# EAGLE design ttl (EAGLE 9.3.1)
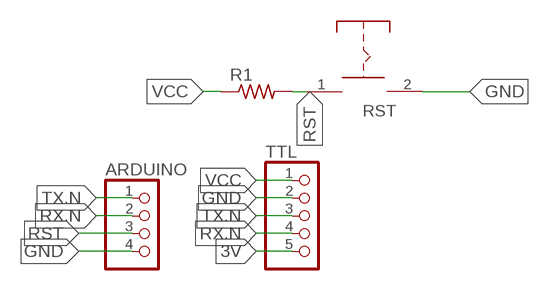
[diagram p0: schematic, sheet 1]

## Parts
ARDUINO  PINHD-1X4  [1X04]
R1  R-US_0204/5  [0204/5]
RST  PUSHBOTTON  [PUSHBOTTON]
TTL  PINHD-1X5  [1X05]

## Nets
3V: TTL.5
GND: ARDUINO.4 RST.2 TTL.2
RST: ARDUINO.3 R1.2 RST.1
RX.N: ARDUINO.2 TTL.4
TX.N: ARDUINO.1 TTL.3
VCC: R1.1 TTL.1

## Library data of the parts
ARDUINO = pinhead:PINHD-1X4: PIN HEADER
R1 = rcl:R-US_: RESISTOR, American symbol; SPICEPREFIX: R
RST = push botton:PUSHBOTTON
TTL = pinhead:PINHD-1X5: PIN HEADER

## Board
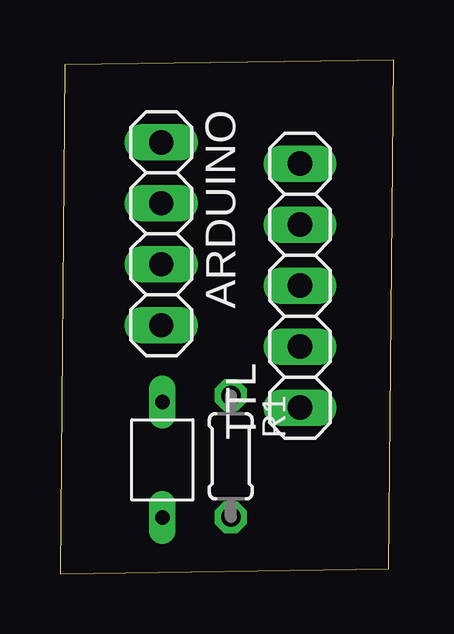
[diagram p1: board, top side]
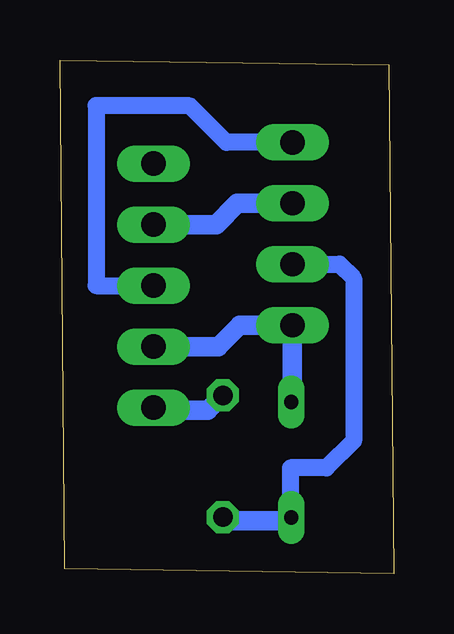
[diagram p2: board, bottom side, seen from below]

Size 13.9 x 21.4 mm. Coordinates in mm from the lower left corner, seen from the top.
Outline: 0,0 13.7,0.2 13.9,21.4 0.2,21.2 0,0
Copper layers (1*16): Top 0.035mm / dielectric 1.5mm / Bottom 0.035mm
Design rules "default": minimum track width 6mil, minimum drill 0.35mm, track to track 6mil, track to pad 6mil, pad to pad 6mil, via to via 6mil, smd to smd 6mil, copper to edge 40mil, drill to drill 6mil, minimum pad ring 10mil, minimum via ring 8mil, stop-mask expansion 4mil, vias tented up to drill 0mil, thermal gap 10mil

### Footprints (pad centres in the part's own frame; a part is rotated, then mirrored left to right if it is on the bottom)
1X04 = drill 1.016 long: 1 -3.81,0; 2 -1.27,0; 3 1.27,0; 4 3.81,0
0204/5 = drill 0.813 octagon: 1 -2.54,0; 2 2.54,0
PUSHBOTTON = drill 0.6 long: 1 -2.27,0; 2 2.54,0
1X05 = drill 1.016 long: 1 -5.08,0; 2 -2.54,0; 3 0,0; 4 2.54,0; 5 5.08,0

### Placement (x,y rotation side)
ARDUINO  4.22,14.16 270 top
R1  7.12,4.89 270 top
RST  4.26,4.6 90 top
TTL  10,12 90 top

### Tracks (layer width: path | path; a pad name or v marks a point on that pad's centre or on a via)
GND
  Bottom 0.813: RST.2 4.22,7.19 ARDUINO.4 6.41,10.35 7.3,9.46 TTL.2
RST
  Bottom 0.7: ARDUINO.3 2.26,12.89 1.67,12.3 1.67,5.53 2.8,4.4 4.3,4.4 4.3,2.24 4.26,2.2
  Bottom 0.813: R1.2 7.01,2.35 6.87,2.2 4.26,2.2 RST.1
RX.N
  Bottom 0.813: ARDUINO.2 6.51,15.43 7.4,14.54 TTL.4
TX.N
  Bottom 0.7: ARDUINO.1 6.97,17.97 8.49,19.49 12.4,19.5 12.4,12 TTL.3
VCC
  Bottom 0.813: TTL.1 9.88,6.8 7.74,6.8 R1.1